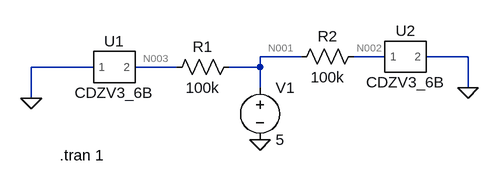
[diagram p0: schematic Draft1.asc]
Draft1.asc, the LTspice schematic file:
Version 4
SHEET 1 880 680
WIRE 256 144 192 144
WIRE 384 144 336 144
WIRE 512 144 448 144
WIRE -64 160 -160 160
WIRE 64 160 0 160
WIRE 192 160 192 144
WIRE 192 160 144 160
WIRE 192 192 192 160
WIRE 512 192 512 144
WIRE -160 208 -160 160
FLAG 512 192 0
FLAG -160 208 0
FLAG 192 272 0
SYMBOL CDZV3_6B -32 160 R0
SYMATTR InstName U1
SYMBOL CDZV3_6B 416 144 R0
SYMATTR InstName U2
SYMBOL voltage 192 176 R0
SYMATTR InstName V1
SYMATTR Value 5
SYMBOL res 160 144 R90
WINDOW 0 0 56 VBottom 2
WINDOW 3 32 56 VTop 2
SYMATTR InstName R1
SYMATTR Value 100k
SYMBOL res 352 128 R90
WINDOW 0 0 56 VBottom 2
WINDOW 3 32 56 VTop 2
SYMATTR InstName R2
SYMATTR Value 100k
TEXT -116 296 Left 2 !.tran 1

The netlist it stands for:
* Draft1.asc
XU1 0 N003 CDZV3_6B  ; pins 1 2
XU2 N002 0 CDZV3_6B  ; pins 1 2
V1 N001 0 5
R1 N001 N003 100k
R2 N002 N001 100k
.tran 1
.lib Z:.\cdzv3_6b.lib
.backanno
.end

* Results of the author's LTspice run, read from the files saved beside the schematic
* Operating Point, zero values left out:
*   V(n003) = 1.994 V
*   V(n002) = 672.7 mV
*   V(n001) = 5 V
*   I(R2) = -43.27 µA
*   I(R1) = 30.06 µA
*   I(V1) = -73.33 µA
*   Ix(u1:1) = -30.06 µA
*   Ix(u1:2) = 30.06 µA
*   Ix(u2:1) = 43.27 µA
*   Ix(u2:2) = -43.27 µA